# Altium project UNO_Breakout.PrjPcb
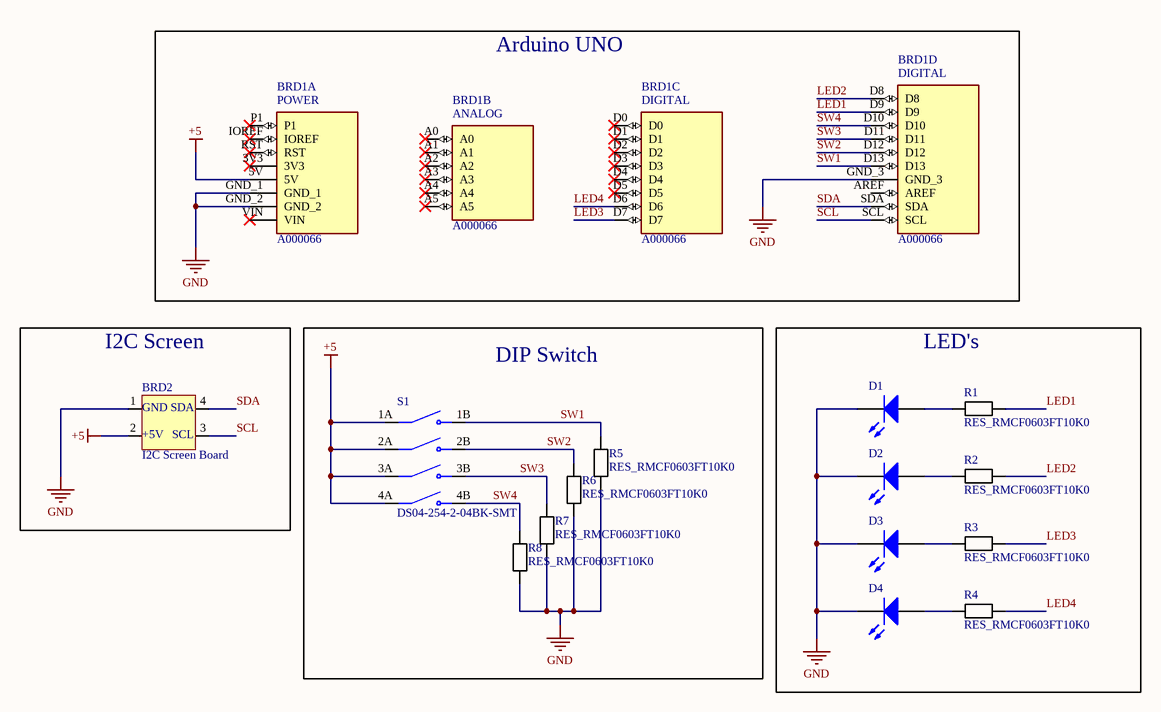
[diagram p0: Scheme1.SchDoc]
1 sheet, 15 parts. Net scope: global (net labels, ports and power ports of the same name join across sheets).
Board file: PCB1.PcbDoc

## Sheet Scheme1.SchDoc
size A4; SheetNumber: 1; SheetTotal: 1

### Parts
BRD1  A000066  [ARDUINO_A000066]  (parts A,B,C,D of 4)
BRD2  I2C Screen Board  [SSD1306 I2C Screen]
D1  Light-Emitting Diode  [Harvatek 0603 LED]  (value not drawn)
D2  Light-Emitting Diode  [Harvatek 0603 LED]  (value not drawn)
D3  Light-Emitting Diode  [Harvatek 0603 LED]  (value not drawn)
D4  Light-Emitting Diode  [Harvatek 0603 LED]  (value not drawn)
R1  RES_RMCF0603FT10K0  [RES_RMCF0603]
R2  RES_RMCF0603FT10K0  [RES_RMCF0603]
R3  RES_RMCF0603FT10K0  [RES_RMCF0603]
R4  RES_RMCF0603FT10K0  [RES_RMCF0603]
R5  RES_RMCF0603FT10K0  [RES_RMCF0603]
R6  RES_RMCF0603FT10K0  [RES_RMCF0603]
R7  RES_RMCF0603FT10K0  [RES_RMCF0603]
R8  RES_RMCF0603FT10K0  [RES_RMCF0603]
S1  DS04-254-2-04BK-SMT  [SW_DS04-254-2-04BK-SMT]

### Blocks framed on the sheet
Arduino UNO: BRD1
I2C Screen: BRD2
DIP Switch: R5-R8 S1
LED's: D1-D4 R1-R4

### Nets
+5: BRD1.5V BRD2.2 S1.1A(COM1) S1.2A(COM2) S1.3A(COM3) S1.4A(COM4)
GND: BRD1.GND_1 BRD1.GND_2 BRD1.GND_3 BRD2.1 D1.2(K) D2.2(K) D3.2(K) D4.2(K) R5.1 R6.1 R7.1 R8.1
LED1: BRD1.D9 R1.2
LED2: BRD1.D8 R2.2
LED3: BRD1.D7 R3.2
LED4: BRD1.D6 R4.2
SCL: BRD1.SCL BRD2.3
SDA: BRD1.SDA BRD2.4
SW1: BRD1.D13 R5.2 S1.1B(NO1)
SW2: BRD1.D12 R6.2 S1.2B(NO2)
SW3: BRD1.D11 R7.2 S1.3B(NO3)
SW4: BRD1.D10 R8.2 S1.4B(NO4)
NetD1_1: D1.1(A) R1.1
NetD2_1: D2.1(A) R2.1
NetD3_1: D3.1(A) R3.1
NetD4_1: D4.1(A) R4.1

Not connected (* = marked no-connect by the designer): BRD1 3V3* A0* A1* A2* A3* A4* A5* AREF D0* D1* D2* D3* D4* D5* IOREF* P1* RST* VIN*

### Notes on the sheet
- (in symbol A000066, part A) POWER
- (in symbol A000066, part B) ANALOG
- (in symbol A000066, part C) DIGITAL
- (in symbol A000066, part D) DIGITAL
- (in symbol SSD1306 I2C Screen) GND; SDA; +5V; SCL

### Library data of the parts
BRD1 = A000066: Microcontroller board based on the ATmega328P.; MF: Arduino; MP: Arduino Uno Rev3; Value: *; SnapEDA_Link: https://www.snapeda.com/parts/Arduino%20Uno%20Rev3/Arduino/view-part/?ref=snap; Availability: Not in stock; Price: None; Package: Non-Standard Arduino; Check_prices: https://www.snapeda.com/parts/Arduino%20Uno%20Rev3/Arduino/view-part/?ref=eda
BRD2 = SSD1306 I2C Screen: Hosyond 0.96 Inch OLED I2C IIC Display Module 12864 128x64 Pixel SSD1306 Mini Self-Luminous OLED Screen Board
D1-D4 = LED: AF: 1; BV: 0; BV_MAX: 1e99; EG: 1.11; FC: 0.5; IBV: 0.001; IS: 1e-14; MJSW: 0.33; NTUN: 30; TNOM: 27; XTI: 3; SimulationGenericComponent: True; CJO: 0; CJP: 0; CTA: 0; CTP: 0; FCS: 0.5; FV_MAX: 1e99; IKF: 0; IKR: 0; ISR: 1e-14; JSW: 0; JTUN: 0; JTUNSW: 0; KEG: 1; KF: 0; LEVEL: 1; N: 1; NBV: 1; NR: 1; NS: 1; PHP: 1; RS: 0; TCV: 0; TLEV: 0; TLEVC: 0; TM1: 0; TM2: 0; TPB: 0; TPHP: 0; TRS: 0; TRS2: 0; TT: 0; TTT1: 0; TTT2: 0; VJ: 1; XTITUN: 3
R1-R8 = RES_RMCF0603FT10K0: RES 10K OHM 1% 1/10W 0603; Manufacturer: Stackpole Electronics Inc; Part Number: RMCF0603FT10K0
S1 = DS04-254-2-04BK-SMT: 4 Position, Surface Mount, 2.54 mm Pitch, Flat Slide Actuator, Flat Bottom, SMT Pin, DIP Switch; MF: CUI Devices; Purchase-URL: https://pricing.snapeda.com/search/part/DS04-254-2-04BK-SMT/?ref=eda; CUI_purchase_URL: https://www.cuidevices.com/product/switches/dip-switches/ds04-254-smt-series?utm_source=snapeda.com&utm_medium=referral&utm_campaign=snapedaBOM; Package: None; SnapEDA_Link: https://www.snapeda.com/parts/DS04-254-2-04BK-SMT/CUI+Devices/view-part/?ref=snap; Value: *; MP: DS04-254-2-04BK-SMT; Check_prices: https://www.snapeda.com/parts/DS04-254-2-04BK-SMT/CUI+Devices/view-part/?ref=eda; Availability: In Stock; Price: None